# EAGLE design main (EAGLE 9.3.1)
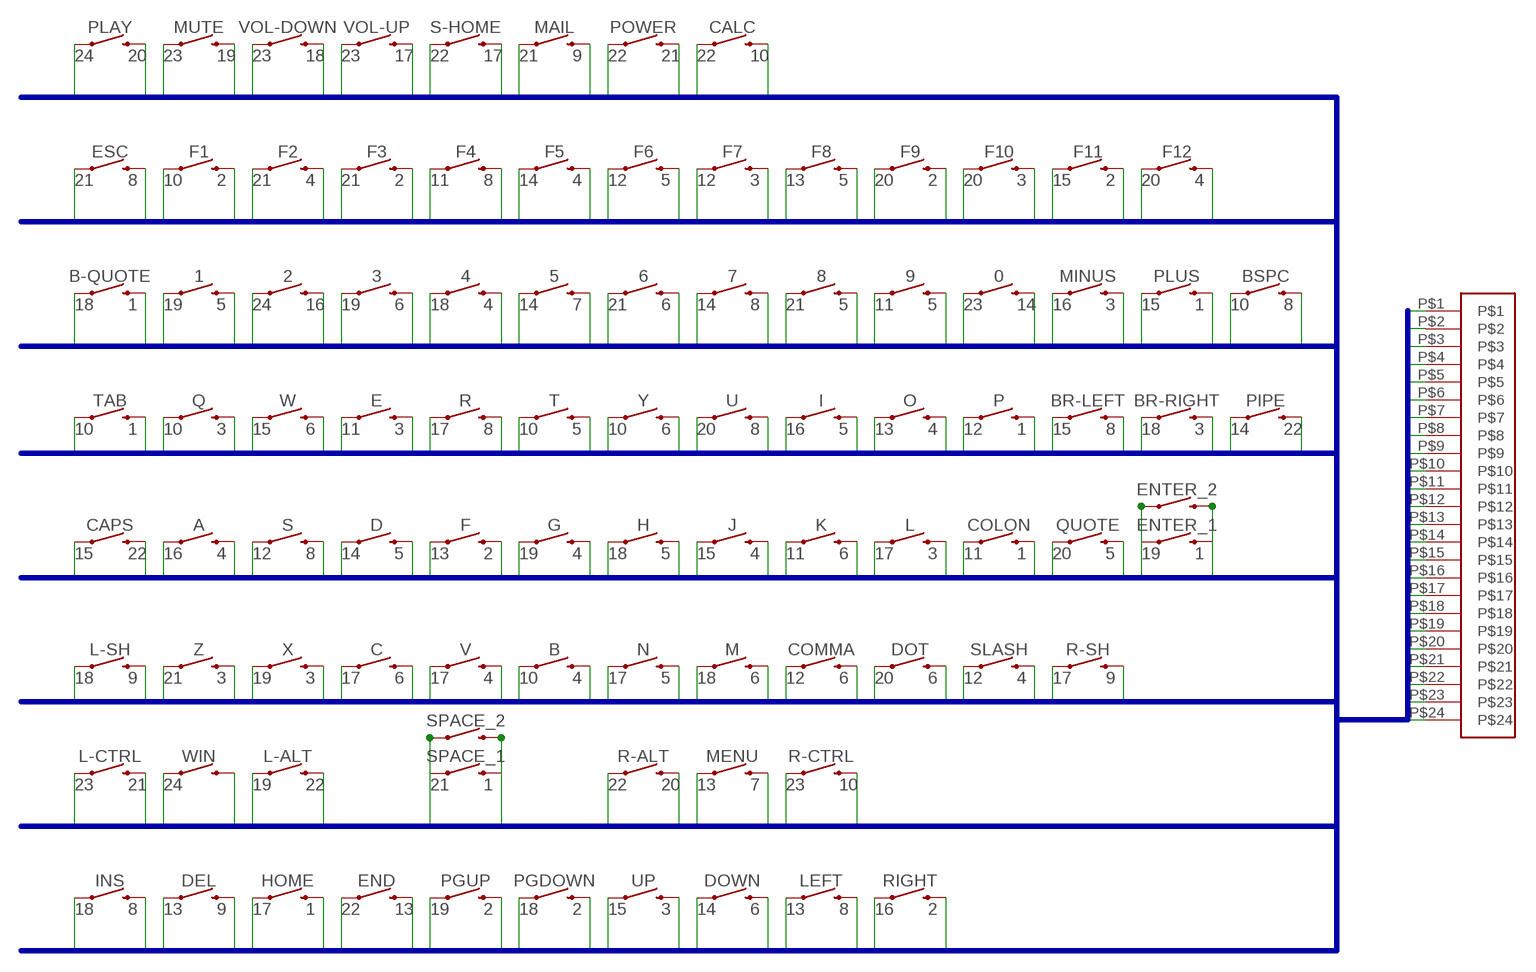
[diagram p0: schematic, sheet 1]

## Parts
0  MOMENTARY-SWITCH-SPST-SMD-5.2MM-TALL  [TACTILE_SWITCH_SMD_5.2MM]
1  MOMENTARY-SWITCH-SPST-SMD-5.2MM-TALL  [TACTILE_SWITCH_SMD_5.2MM]
2  MOMENTARY-SWITCH-SPST-SMD-5.2MM-TALL  [TACTILE_SWITCH_SMD_5.2MM]
3  MOMENTARY-SWITCH-SPST-SMD-5.2MM-TALL  [TACTILE_SWITCH_SMD_5.2MM]
4  MOMENTARY-SWITCH-SPST-SMD-5.2MM-TALL  [TACTILE_SWITCH_SMD_5.2MM]
5  MOMENTARY-SWITCH-SPST-SMD-5.2MM-TALL  [TACTILE_SWITCH_SMD_5.2MM]
6  MOMENTARY-SWITCH-SPST-SMD-5.2MM-TALL  [TACTILE_SWITCH_SMD_5.2MM]
7  MOMENTARY-SWITCH-SPST-SMD-5.2MM-TALL  [TACTILE_SWITCH_SMD_5.2MM]
8  MOMENTARY-SWITCH-SPST-SMD-5.2MM-TALL  [TACTILE_SWITCH_SMD_5.2MM]
9  MOMENTARY-SWITCH-SPST-SMD-5.2MM-TALL  [TACTILE_SWITCH_SMD_5.2MM]
A  MOMENTARY-SWITCH-SPST-SMD-5.2MM-TALL  [TACTILE_SWITCH_SMD_5.2MM]
B  MOMENTARY-SWITCH-SPST-SMD-5.2MM-TALL  [TACTILE_SWITCH_SMD_5.2MM]
B-QUOTE  MOMENTARY-SWITCH-SPST-SMD-5.2MM-TALL  [TACTILE_SWITCH_SMD_5.2MM]
BR-LEFT  MOMENTARY-SWITCH-SPST-SMD-5.2MM-TALL  [TACTILE_SWITCH_SMD_5.2MM]
BR-RIGHT  MOMENTARY-SWITCH-SPST-SMD-5.2MM-TALL  [TACTILE_SWITCH_SMD_5.2MM]
BSPC  MOMENTARY-SWITCH-SPST-SMD-5.2MM-TALL  [TACTILE_SWITCH_SMD_5.2MM]
C  MOMENTARY-SWITCH-SPST-SMD-5.2MM-TALL  [TACTILE_SWITCH_SMD_5.2MM]
CALC  MOMENTARY-SWITCH-SPST-SMD-5.2MM-TALL  [TACTILE_SWITCH_SMD_5.2MM]
CAPS  MOMENTARY-SWITCH-SPST-SMD-5.2MM-TALL  [TACTILE_SWITCH_SMD_5.2MM]
COLON  MOMENTARY-SWITCH-SPST-SMD-5.2MM-TALL  [TACTILE_SWITCH_SMD_5.2MM]
COMMA  MOMENTARY-SWITCH-SPST-SMD-5.2MM-TALL  [TACTILE_SWITCH_SMD_5.2MM]
D  MOMENTARY-SWITCH-SPST-SMD-5.2MM-TALL  [TACTILE_SWITCH_SMD_5.2MM]
DEL  MOMENTARY-SWITCH-SPST-SMD-5.2MM-TALL  [TACTILE_SWITCH_SMD_5.2MM]
DOT  MOMENTARY-SWITCH-SPST-SMD-5.2MM-TALL  [TACTILE_SWITCH_SMD_5.2MM]
DOWN  MOMENTARY-SWITCH-SPST-SMD-5.2MM-TALL  [TACTILE_SWITCH_SMD_5.2MM]
E  MOMENTARY-SWITCH-SPST-SMD-5.2MM-TALL  [TACTILE_SWITCH_SMD_5.2MM]
END  MOMENTARY-SWITCH-SPST-SMD-5.2MM-TALL  [TACTILE_SWITCH_SMD_5.2MM]
ENTER_1  MOMENTARY-SWITCH-SPST-SMD-5.2MM-TALL  [TACTILE_SWITCH_SMD_5.2MM]
ENTER_2  MOMENTARY-SWITCH-SPST-SMD-5.2MM-TALL  [TACTILE_SWITCH_SMD_5.2MM]
ESC  MOMENTARY-SWITCH-SPST-SMD-5.2MM-TALL  [TACTILE_SWITCH_SMD_5.2MM]
F  MOMENTARY-SWITCH-SPST-SMD-5.2MM-TALL  [TACTILE_SWITCH_SMD_5.2MM]
F1  MOMENTARY-SWITCH-SPST-SMD-5.2MM-TALL  [TACTILE_SWITCH_SMD_5.2MM]
F2  MOMENTARY-SWITCH-SPST-SMD-5.2MM-TALL  [TACTILE_SWITCH_SMD_5.2MM]
F3  MOMENTARY-SWITCH-SPST-SMD-5.2MM-TALL  [TACTILE_SWITCH_SMD_5.2MM]
F4  MOMENTARY-SWITCH-SPST-SMD-5.2MM-TALL  [TACTILE_SWITCH_SMD_5.2MM]
F5  MOMENTARY-SWITCH-SPST-SMD-5.2MM-TALL  [TACTILE_SWITCH_SMD_5.2MM]
F6  MOMENTARY-SWITCH-SPST-SMD-5.2MM-TALL  [TACTILE_SWITCH_SMD_5.2MM]
F7  MOMENTARY-SWITCH-SPST-SMD-5.2MM-TALL  [TACTILE_SWITCH_SMD_5.2MM]
F8  MOMENTARY-SWITCH-SPST-SMD-5.2MM-TALL  [TACTILE_SWITCH_SMD_5.2MM]
F9  MOMENTARY-SWITCH-SPST-SMD-5.2MM-TALL  [TACTILE_SWITCH_SMD_5.2MM]
F10  MOMENTARY-SWITCH-SPST-SMD-5.2MM-TALL  [TACTILE_SWITCH_SMD_5.2MM]
F11  MOMENTARY-SWITCH-SPST-SMD-5.2MM-TALL  [TACTILE_SWITCH_SMD_5.2MM]
F12  MOMENTARY-SWITCH-SPST-SMD-5.2MM-TALL  [TACTILE_SWITCH_SMD_5.2MM]
G  MOMENTARY-SWITCH-SPST-SMD-5.2MM-TALL  [TACTILE_SWITCH_SMD_5.2MM]
H  MOMENTARY-SWITCH-SPST-SMD-5.2MM-TALL  [TACTILE_SWITCH_SMD_5.2MM]
HOME  MOMENTARY-SWITCH-SPST-SMD-5.2MM-TALL  [TACTILE_SWITCH_SMD_5.2MM]
I  MOMENTARY-SWITCH-SPST-SMD-5.2MM-TALL  [TACTILE_SWITCH_SMD_5.2MM]
INS  MOMENTARY-SWITCH-SPST-SMD-5.2MM-TALL  [TACTILE_SWITCH_SMD_5.2MM]
J  MOMENTARY-SWITCH-SPST-SMD-5.2MM-TALL  [TACTILE_SWITCH_SMD_5.2MM]
K  MOMENTARY-SWITCH-SPST-SMD-5.2MM-TALL  [TACTILE_SWITCH_SMD_5.2MM]
L  MOMENTARY-SWITCH-SPST-SMD-5.2MM-TALL  [TACTILE_SWITCH_SMD_5.2MM]
L-ALT  MOMENTARY-SWITCH-SPST-SMD-5.2MM-TALL  [TACTILE_SWITCH_SMD_5.2MM]
L-CTRL  MOMENTARY-SWITCH-SPST-SMD-5.2MM-TALL  [TACTILE_SWITCH_SMD_5.2MM]
L-SH  MOMENTARY-SWITCH-SPST-SMD-5.2MM-TALL  [TACTILE_SWITCH_SMD_5.2MM]
LEFT  MOMENTARY-SWITCH-SPST-SMD-5.2MM-TALL  [TACTILE_SWITCH_SMD_5.2MM]
M  MOMENTARY-SWITCH-SPST-SMD-5.2MM-TALL  [TACTILE_SWITCH_SMD_5.2MM]
MAIL  MOMENTARY-SWITCH-SPST-SMD-5.2MM-TALL  [TACTILE_SWITCH_SMD_5.2MM]
MENU  MOMENTARY-SWITCH-SPST-SMD-5.2MM-TALL  [TACTILE_SWITCH_SMD_5.2MM]
MINUS  MOMENTARY-SWITCH-SPST-SMD-5.2MM-TALL  [TACTILE_SWITCH_SMD_5.2MM]
MUTE  MOMENTARY-SWITCH-SPST-SMD-5.2MM-TALL  [TACTILE_SWITCH_SMD_5.2MM]
N  MOMENTARY-SWITCH-SPST-SMD-5.2MM-TALL  [TACTILE_SWITCH_SMD_5.2MM]
O  MOMENTARY-SWITCH-SPST-SMD-5.2MM-TALL  [TACTILE_SWITCH_SMD_5.2MM]
P  MOMENTARY-SWITCH-SPST-SMD-5.2MM-TALL  [TACTILE_SWITCH_SMD_5.2MM]
PGDOWN  MOMENTARY-SWITCH-SPST-SMD-5.2MM-TALL  [TACTILE_SWITCH_SMD_5.2MM]
PGUP  MOMENTARY-SWITCH-SPST-SMD-5.2MM-TALL  [TACTILE_SWITCH_SMD_5.2MM]
PIPE  MOMENTARY-SWITCH-SPST-SMD-5.2MM-TALL  [TACTILE_SWITCH_SMD_5.2MM]
PLAY  MOMENTARY-SWITCH-SPST-SMD-5.2MM-TALL  [TACTILE_SWITCH_SMD_5.2MM]
PLUS  MOMENTARY-SWITCH-SPST-SMD-5.2MM-TALL  [TACTILE_SWITCH_SMD_5.2MM]
POWER  MOMENTARY-SWITCH-SPST-SMD-5.2MM-TALL  [TACTILE_SWITCH_SMD_5.2MM]
Q  MOMENTARY-SWITCH-SPST-SMD-5.2MM-TALL  [TACTILE_SWITCH_SMD_5.2MM]
QUOTE  MOMENTARY-SWITCH-SPST-SMD-5.2MM-TALL  [TACTILE_SWITCH_SMD_5.2MM]
R  MOMENTARY-SWITCH-SPST-SMD-5.2MM-TALL  [TACTILE_SWITCH_SMD_5.2MM]
R-ALT  MOMENTARY-SWITCH-SPST-SMD-5.2MM-TALL  [TACTILE_SWITCH_SMD_5.2MM]
R-CTRL  MOMENTARY-SWITCH-SPST-SMD-5.2MM-TALL  [TACTILE_SWITCH_SMD_5.2MM]
R-SH  MOMENTARY-SWITCH-SPST-SMD-5.2MM-TALL  [TACTILE_SWITCH_SMD_5.2MM]
RIGHT  MOMENTARY-SWITCH-SPST-SMD-5.2MM-TALL  [TACTILE_SWITCH_SMD_5.2MM]
S  MOMENTARY-SWITCH-SPST-SMD-5.2MM-TALL  [TACTILE_SWITCH_SMD_5.2MM]
S-HOME  MOMENTARY-SWITCH-SPST-SMD-5.2MM-TALL  [TACTILE_SWITCH_SMD_5.2MM]
SLASH  MOMENTARY-SWITCH-SPST-SMD-5.2MM-TALL  [TACTILE_SWITCH_SMD_5.2MM]
SPACE_1  MOMENTARY-SWITCH-SPST-SMD-5.2MM-TALL  [TACTILE_SWITCH_SMD_5.2MM]
SPACE_2  MOMENTARY-SWITCH-SPST-SMD-5.2MM-TALL  [TACTILE_SWITCH_SMD_5.2MM]
T  MOMENTARY-SWITCH-SPST-SMD-5.2MM-TALL  [TACTILE_SWITCH_SMD_5.2MM]
TAB  MOMENTARY-SWITCH-SPST-SMD-5.2MM-TALL  [TACTILE_SWITCH_SMD_5.2MM]
U  MOMENTARY-SWITCH-SPST-SMD-5.2MM-TALL  [TACTILE_SWITCH_SMD_5.2MM]
U$1  LOGITECH_KBD_24_PIN_CONNECTOR  [LOGITECH_KBD_24_PIN_CONNECTOR]
UP  MOMENTARY-SWITCH-SPST-SMD-5.2MM-TALL  [TACTILE_SWITCH_SMD_5.2MM]
V  MOMENTARY-SWITCH-SPST-SMD-5.2MM-TALL  [TACTILE_SWITCH_SMD_5.2MM]
VOL-DOWN  MOMENTARY-SWITCH-SPST-SMD-5.2MM-TALL  [TACTILE_SWITCH_SMD_5.2MM]
VOL-UP  MOMENTARY-SWITCH-SPST-SMD-5.2MM-TALL  [TACTILE_SWITCH_SMD_5.2MM]
W  MOMENTARY-SWITCH-SPST-SMD-5.2MM-TALL  [TACTILE_SWITCH_SMD_5.2MM]
WIN  MOMENTARY-SWITCH-SPST-SMD-5.2MM-TALL  [TACTILE_SWITCH_SMD_5.2MM]
X  MOMENTARY-SWITCH-SPST-SMD-5.2MM-TALL  [TACTILE_SWITCH_SMD_5.2MM]
Y  MOMENTARY-SWITCH-SPST-SMD-5.2MM-TALL  [TACTILE_SWITCH_SMD_5.2MM]
Z  MOMENTARY-SWITCH-SPST-SMD-5.2MM-TALL  [TACTILE_SWITCH_SMD_5.2MM]

## Nets
1: B-QUOTE.3 COLON.3 ENTER_1.3 ENTER_2.3 HOME.3 P.3 PLUS.3 SPACE_1.3 SPACE_2.3 TAB.3 U$1.P$1
2: F1.3 F3.3 F9.3 F11.3 F.3 PGDOWN.3 PGUP.3 RIGHT.3 U$1.P$2
3: BR-RIGHT.3 E.3 F7.3 F10.3 L.3 MINUS.3 Q.3 U$1.P$3 UP.3 X.3 Z.3
4: 4.3 A.3 B.3 F2.3 F5.3 F12.3 G.3 J.3 O.3 SLASH.3 U$1.P$4 V.3
5: 1.3 8.3 9.3 D.3 F6.3 F8.3 H.3 I.3 N.3 QUOTE.3 T.3 U$1.P$5
6: 3.3 6.3 C.3 COMMA.3 DOT.3 DOWN.3 K.3 M.3 U$1.P$6 W.3 Y.3
7: 5.3 MENU.3 U$1.P$7
8: 7.3 BR-LEFT.3 BSPC.3 ESC.3 F4.3 INS.3 LEFT.3 R.3 S.3 U$1.P$8 U.3
9: DEL.3 L-SH.3 MAIL.3 R-SH.3 U$1.P$9
10: B.1 BSPC.1 CALC.3 F1.1 Q.1 R-CTRL.3 T.1 TAB.1 U$1.P$10 Y.1
11: 9.1 COLON.1 E.1 F4.1 K.1 U$1.P$11 WIN.3
12: COMMA.1 F6.1 F7.1 P.1 S.1 SLASH.1 U$1.P$12
13: DEL.1 END.3 F8.1 F.1 LEFT.1 MENU.1 O.1 U$1.P$13
14: 0.3 5.1 7.1 D.1 DOWN.1 F5.1 PIPE.1 U$1.P$14
15: BR-LEFT.1 CAPS.1 F11.1 J.1 PLUS.1 U$1.P$15 UP.1 W.1
16: 2.3 A.1 I.1 MINUS.1 RIGHT.1 U$1.P$16
17: C.1 HOME.1 L.1 N.1 R-SH.1 R.1 S-HOME.3 U$1.P$17 V.1 VOL-UP.3
18: 4.1 B-QUOTE.1 BR-RIGHT.1 H.1 INS.1 L-SH.1 M.1 PGDOWN.1 U$1.P$18 VOL-DOWN.3
19: 1.1 3.1 ENTER_1.1 ENTER_2.1 G.1 L-ALT.1 MUTE.3 PGUP.1 U$1.P$19 X.1
20: DOT.1 F9.1 F10.1 F12.1 PLAY.3 QUOTE.1 R-ALT.3 U$1.P$20 U.1
21: 6.1 8.1 ESC.1 F2.1 F3.1 L-CTRL.3 MAIL.1 POWER.3 SPACE_1.1 SPACE_2.1 U$1.P$21 Z.1
22: CALC.1 CAPS.3 END.1 L-ALT.3 PIPE.3 POWER.1 R-ALT.1 S-HOME.1 U$1.P$22
23: 0.1 L-CTRL.1 MUTE.1 R-CTRL.1 U$1.P$23 VOL-DOWN.1 VOL-UP.1
24: 2.1 PLAY.1 U$1.P$24 WIN.1

## Buses
1,2,3,4,5,6,7,8,9,10,11,12,13,14,15,16,17,18,19,20,21,22,23,24

## Library data of the parts
0 1-9 A B B-QUOTE BR-LEFT BR-RIGHT BSPC C CALC CAPS COLON COMMA D DEL DOT DOWN E END ENTER_1 ENTER_2 ESC F F1-F12 G H HOME I INS J K L L-ALT L-CTRL L-SH LEFT M MAIL MENU MINUS MUTE N O P PGDOWN PGUP PIPE PLAY PLUS POWER Q QUOTE R R-ALT R-CTRL R-SH RIGHT S S-HOME SLASH SPACE_1 SPACE_2 T TAB U UP V VOL-DOWN VOL-UP W WIN X Y Z = SparkFun-Switches:MOMENTARY-SWITCH-SPST: Momentary Switch (Pushbutton) - SPST Normally-open (NO) SPST momentary switches (buttons, pushbuttons). Variants PTH-12MM - 12mm square, through-hole Momentary Pushbutton Switch - 12mm Square <https://www.sparkfun.com/products/9190> (COM-09190) PTH-6.0MM, PTH-6.0MM-KIT - 6.0mm square, through-hole Mini Pushbutton Switch <https://www.sparkfun.com/products/97> (COM-00097) KIT package intended for soldering kit's - only one side of pads' copper is exposed. PTH-RIGHT-ANGLE-KIT - Right-angle, through-hole Right Angle Tactile Button <https://www.sparkfun.com/products/10791> - Used on SparkFun BigTime Watch Kit <https://www.sparkfun.com/products/11734> SMD-12MM - 12mm square, surface-mount Tactile Button - SMD (12mm) <https://www.sparkfun.com/products/12993> (COM-12993) Used on SparkFun PicoBoard <https://www.sparkfun.com/products/11888> SMD-4.5MM - 4.5mm Square Trackball Switch Used on SparkFun Blackberry Trackballer Breakout <https://www.sparkfun.com/products/13169> SMD-4.6MMX2.8MM - 4.60mm x 2.80mm, surface mount Used on SparkFun SAMD21 Mini Breakout <https://www.sparkfun.com/products/13664> SMD-5.2MM, SMD-5.2-REDUNDANT - 5.2mm square, surface-mount Mini Pushbutton Switch - SMD <https://www.sparkfun.com/products/8720> (COM-08720) Used on Arduino Pro Mini <https://www.sparkfun.com/products/11114> REDUNDANT package connects both switch circuits together SMD-6.0X3.5MM - 6.0 x 3.5mm, surface mount Momentary Reset Switch SMD <https://www.sparkfun.com/products/8229> (COM-08229) SMD-6.2MM-TALL - 6.2mm square, surface mount Tactile Button - SMD (6mm) <https://www.sparkfun.com/products/12992> Used on SparkFun Digital Sandbox <https://www.sparkfun.com/products/12651> SMD-RIGHT-ANGLE - Right-angle, surface mount Used on SparkFun Block for Intel® Edison - Arduino <https://www.sparkfun.com/products/13036>; PROD_ID: SWCH-14139
U$1 = Andrew:LOGITECH_KBD_24_PIN_CONNECTOR

## Net classes
0 default: width 0.203 mm, drill 0.3 mm, clearance 0.203 mm

## Board
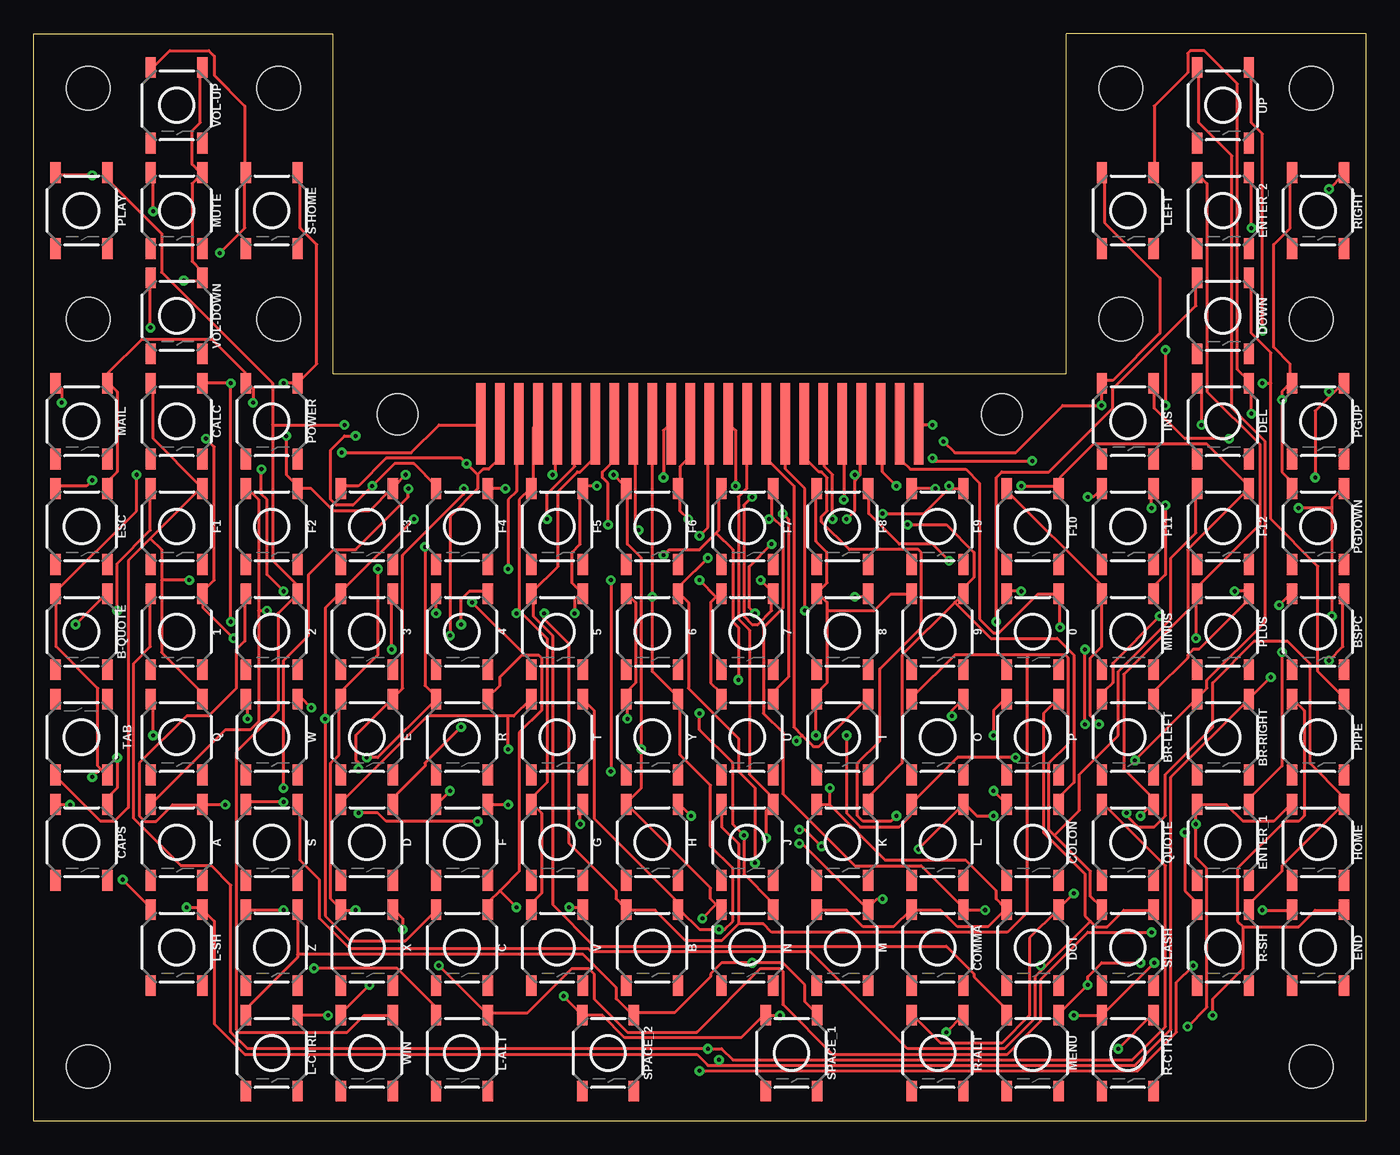
[diagram p1: board, top side]
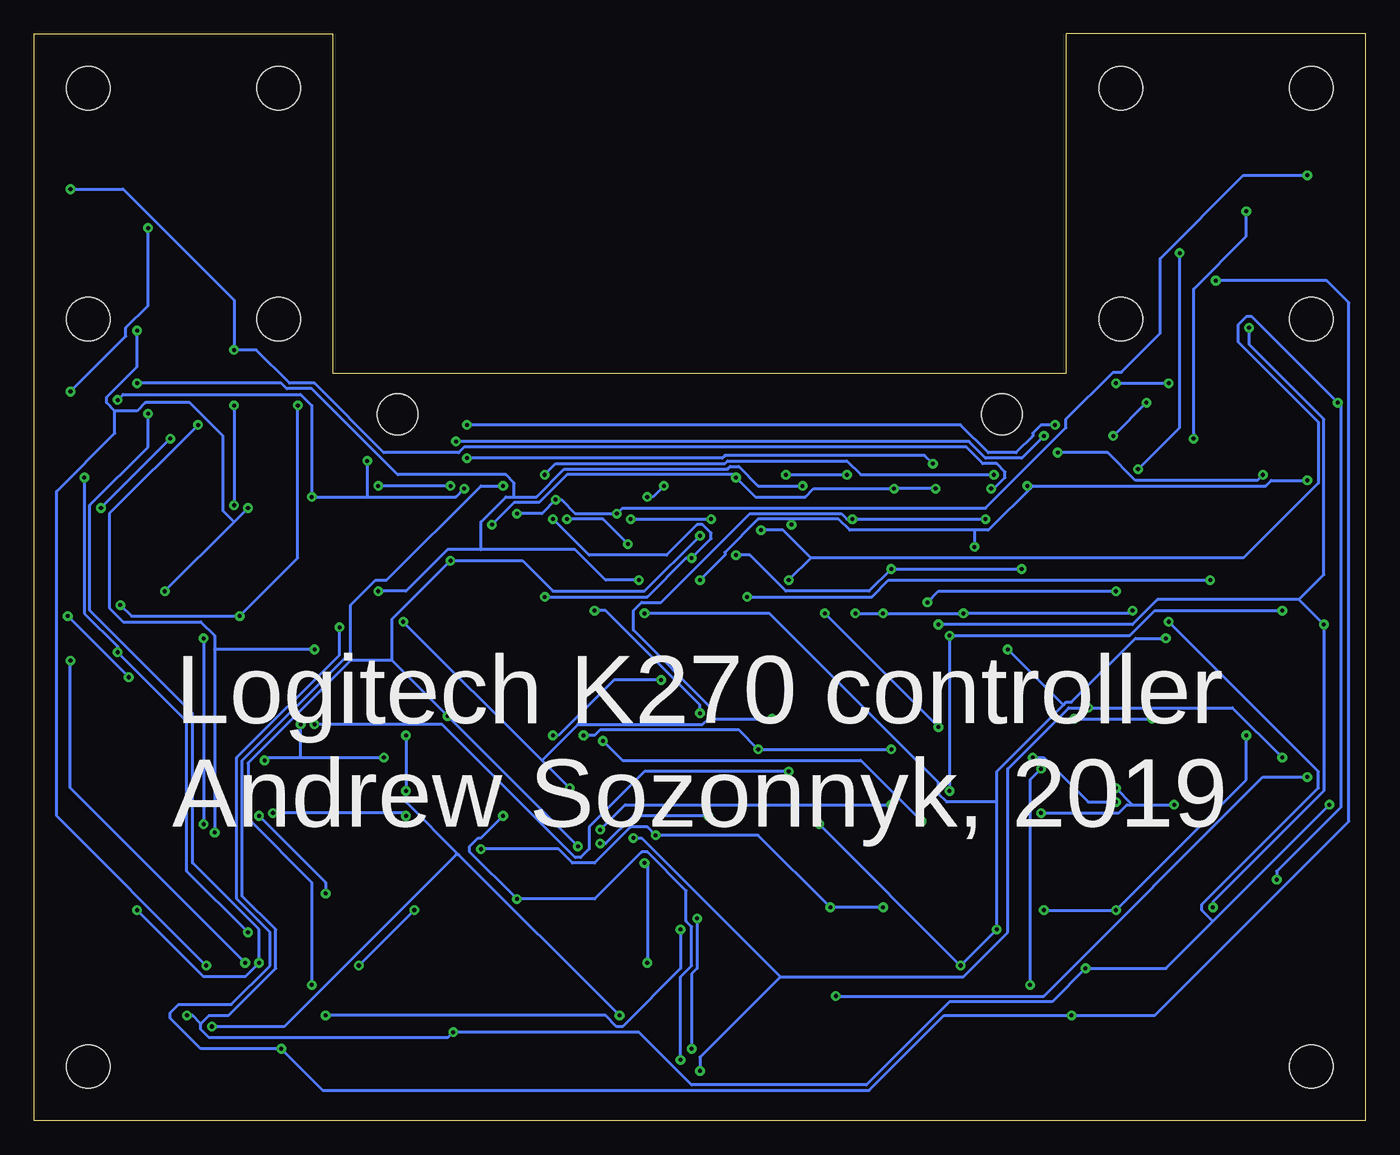
[diagram p2: board, bottom side, seen from below]

Size 98 x 80 mm. Coordinates in mm from the lower left corner, seen from the top.
Outline: 0,0 0,80 22,80 22,55 76,55 76,80 98,80 98,0 0,0
Copper layers (1*16): Top 0.035mm / dielectric 1.5mm / Bottom 0.035mm
Design rules "PCBway": minimum track width 6mil, minimum drill 0.3mm, track to track 0.205mm, track to pad 0.205mm, pad to pad 0.205mm, via to via 0.205mm, smd to smd 8mil, copper to edge 40mil, drill to drill 8mil, minimum pad ring 10mil, minimum via ring 8mil, stop-mask expansion 4mil, vias tented up to drill 25mil, thermal gap 10mil
Holes 3.2 mm at 4,4 94,4 4,76 94,76 18,76 80,76 4,59 18,59 80,59 94,59
Holes 3 mm at 26.75,52 71.25,52

### Footprints (pad centres in the part's own frame; a part is rotated, then mirrored left to right if it is on the bottom)
TACTILE_SWITCH_SMD_5.2MM = smd 1.524 x 0.762: 1 -2.794,1.905; 2 2.794,1.905; 3 -2.794,-1.905; 4 2.794,-1.905
LOGITECH_KBD_24_PIN_CONNECTOR = smd 0.7 x 6: P$1 0,0; P$2 1.4,0; P$3 2.8,0; P$4 4.2,0; P$5 5.6,0; P$6 7,0; P$7 8.4,0; P$8 9.8,0; P$9 11.2,0; P$10 12.6,0; P$11 14,0; P$12 15.4,0; P$13 16.8,0; P$14 18.2,0; P$15 19.6,0; P$16 21,0; P$17 22.4,0; P$18 23.8,0; P$19 25.2,0; P$20 26.6,0; P$21 28,0; P$22 29.4,0; P$23 30.8,0; P$24 32.2,0

### Placement (x,y rotation side)
0  73.5,36 270 top
1  10.5,36 270 top
2  17.5,36 270 top
3  24.5,36 270 top
4  31.5,36 270 top
5  38.5,36 270 top
6  45.5,36 270 top
7  52.5,36 270 top
8  59.5,36 270 top
9  66.5,36 270 top
A  10.5,20.5 270 top
B  45.5,12.75 270 top
B-QUOTE  3.5,36 270 top
BR-LEFT  80.5,28.25 270 top
BR-RIGHT  87.5,28.25 270 top
BSPC  94.5,36 270 top
C  31.5,12.75 270 top
CALC  10.5,51.5 270 top
CAPS  3.5,20.5 270 top
COLON  73.5,20.5 270 top
COMMA  66.5,12.75 270 top
D  24.5,20.5 270 top
DEL  87.5,51.5 270 top
DOT  73.5,12.75 270 top
DOWN  87.5,59.25 270 top
E  24.5,28.25 270 top
END  94.5,12.75 270 top
ENTER_1  87.5,20.5 270 top
ENTER_2  87.5,67 270 top
ESC  3.5,43.75 270 top
F  31.5,20.5 270 top
F1  10.5,43.75 270 top
F2  17.5,43.75 270 top
F3  24.5,43.75 270 top
F4  31.5,43.75 270 top
F5  38.5,43.75 270 top
F6  45.5,43.75 270 top
F7  52.5,43.75 270 top
F8  59.5,43.75 270 top
F9  66.5,43.75 270 top
F10  73.5,43.75 270 top
F11  80.5,43.75 270 top
F12  87.5,43.75 270 top
G  38.5,20.5 270 top
H  45.5,20.5 270 top
HOME  94.5,20.5 270 top
I  59.5,28.25 270 top
INS  80.5,51.5 270 top
J  52.5,20.5 270 top
K  59.5,20.5 270 top
L  66.5,20.5 270 top
L-ALT  31.5,5 270 top
L-CTRL  17.5,5 270 top
L-SH  10.5,12.75 270 top
LEFT  80.5,67 270 top
M  59.5,12.75 270 top
MAIL  3.5,51.5 270 top
MENU  73.5,5 270 top
MINUS  80.5,36 270 top
MUTE  10.5,67 270 top
N  52.5,12.75 270 top
O  66.5,28.25 270 top
P  73.5,28.25 270 top
PGDOWN  94.5,43.75 270 top
PGUP  94.5,51.5 270 top
PIPE  94.5,28.25 270 top
PLAY  3.5,67 270 top
PLUS  87.5,36 270 top
POWER  17.5,51.5 270 top
Q  10.5,28.25 270 top
QUOTE  80.5,20.5 270 top
R  31.5,28.25 270 top
R-ALT  66.5,5 270 top
R-CTRL  80.5,5 270 top
R-SH  87.5,12.75 270 top
RIGHT  94.5,67 270 top
S  17.5,20.5 270 top
S-HOME  17.5,67 270 top
SLASH  80.5,12.75 270 top
SPACE_1  55.75,5 270 top
SPACE_2  42.25,5 270 top
T  38.5,28.25 270 top
TAB  3.5,28.25 90 top
U  52.5,28.25 270 top
U$1  32.9,51.3 0 top
UP  87.5,74.75 270 top
V  38.5,12.75 270 top
VOL-DOWN  10.5,59.25 270 top
VOL-UP  10.5,74.75 270 top
W  17.5,28.25 270 top
WIN  24.5,5 270 top
X  24.5,12.75 270 top
Y  45.5,28.25 270 top
Z  17.5,12.75 270 top

### Tracks (layer width: path | path; a pad name or v marks a point on that pad's centre or on a via)
1  (via drill 0.3)
  Top 0.203: 4.9,25.92 5.31,25.51 TAB.3 | 4.9,25.92 4.69,26.12 4.69,31.84 1.63,34.9 1.63,38.78 B-QUOTE.3 1.63,38.98 7.55,44.9 v7.55,47.55 | v22.66,49.19 27.76,49.19 29.8,51.23 32.86,51.23 U$1.P$1 | HOME.3 92.46,23.27 91.23,22.04 88.99,22.04 87.76,23.27 85.72,23.27 ENTER_1.3 85.52,23.27 v85.52,21.84 85.52,19.39 86.33,18.57 86.33,8.37 v84.91,6.94 | ENTER_2.3 85.72,69.6 86.33,68.99 86.33,53.68 90.21,49.8 90.21,43.88 85.72,39.39 85.72,38.98 PLUS.3 85.52,38.78 v85.52,35.51 | v70.62,24.29 71.44,23.47 COLON.3 | v70.62,28.37 70.62,30.21 71.44,31.02 P.3 | v54.9,7.76 53.88,7.76 SPACE_1.3 53.68,7.76 52.05,6.12 43.47,6.12 41.84,7.76 40.41,7.76 SPACE_2.3 40.21,7.96 v38.98,9.18 | v4.29,25.31 4.9,25.92
  Bottom 0.203: v22.66,49.19 18.98,49.19 16.94,47.15 7.96,47.15 v7.55,47.55 | v85.52,35.51 v85.52,21.84 | v70.62,28.37 v70.62,24.29 70.62,23.47 66.74,19.59 | v54.9,7.76 66.74,19.59 | v84.91,6.94 79.6,6.94 66.94,19.59 66.74,19.59 | v4.29,25.31 7.55,25.31 23.68,9.18 v38.98,9.18
2  (via drill 0.3)
  Top 0.203: v66.33,46.53 64.7,46.53 F9.3 | v77.56,45.92 77.97,45.92 78.58,46.53 F11.3 | PGDOWN.3 92.46,46.74 92.46,47.15 91.84,47.76 v91.84,53.07 91.84,53.68 92.46,54.29 PGUP.3 92.46,54.49 92.46,55.72 91.23,56.94 91.23,64.5 92.46,65.72 92.46,69.6 RIGHT.3 | v30.61,24.29 29.8,23.47 F.3 | v30.61,35.72 30.61,44.49 32.66,46.53 32.66,47.55 | 32.66,47.55 33.06,47.96 33.47,47.96 34.29,48.78 34.29,51.23 U$1.P$2 | v6.12,37.55 6.12,41.02 8.57,43.47 8.57,46.53 F1.3 | 32.66,47.55 v31.84,48.37 31.43,48.78 25.92,48.78 23.88,46.74 22.66,46.74 F3.3 | v73.48,48.58 66.33,48.58 v66.13,48.78
  Bottom 0.203: v66.33,46.53 66.94,45.92 73.48,45.92 | 73.48,45.92 v77.56,45.92 77.56,52.66 78.37,53.47 91.44,53.47 v91.84,53.07 | v30.61,24.29 v30.61,35.72 17.35,35.72 15.51,37.55 v6.12,37.55 | v73.48,48.58 73.48,45.92 | v66.13,48.78 47.35,48.78 47.15,48.98 32.45,48.98 v31.84,48.37
3  (via drill 0.3)
  Top 0.203: F10.3 71.44,46.53 78.58,39.39 78.58,38.98 MINUS.3 78.58,38.78 78.58,34.9 77.76,34.09 77.76,29.8 v78.37,29.19 | v72.25,26.74 67.97,26.74 64.7,23.47 L.3 64.5,23.27 64.5,22.45 63.68,21.64 60.82,21.64 59.8,22.66 v59.8,28.37 | v81.03,26.53 85.52,31.02 BR-RIGHT.3 85.72,31.23 86.33,31.84 86.33,32.45 90.62,36.74 90.62,50.01 88.17,52.45 88.17,71.03 85.72,73.48 85.72,77.35 UP.3 | v18.37,15.51 15.72,15.51 Z.3 | v23.68,15.51 22.66,15.51 X.3 22.45,15.72 21.84,16.33 21.84,26.33 22.45,26.94 22.45,31.02 E.3 22.66,31.23 22.66,31.64 25.31,34.29 v25.31,40.62 | v8.78,28.37 8.78,31.02 Q.3 | 50.21,43.27 48.98,42.05 46.74,42.05 v46.33,41.64 | 50.21,43.27 50.41,43.47 50.41,46.53 F7.3 | v34.9,40.62 34.9,45.72 35.51,46.33 35.51,51.23 U$1.P$3 | v51.84,32.45 51.84,36.33 51.43,36.74 51.43,42.05 50.21,43.27
  Bottom 0.203: 78.37,26.74 80.82,26.74 v81.03,26.53 | 78.37,26.74 v72.25,26.74 | 78.37,26.74 v78.37,29.19 | v23.68,15.51 v18.37,15.51 8.78,25.1 v8.78,28.37 | v46.33,41.64 45.31,41.64 42.66,38.98 36.53,38.98 v34.9,40.62 v25.31,40.62 | v59.8,28.37 59.39,28.37 55.31,32.45 v51.84,32.45
4  (via drill 0.3)
  Top 0.203: 16.53,37.55 16.53,45.72 15.72,46.53 F2.3 | 16.53,37.55 16.53,29.39 15.92,28.78 14.08,28.78 8.78,23.47 A.3 | v29.59,37.35 4.3 | 16.53,37.55 v17.14,37.55 | V.3 36.74,15.72 36.74,16.12 37.35,16.74 37.35,22.66 36.74,23.27 G.3 36.74,23.47 36.74,23.88 37.76,24.9 37.76,35.51 35.72,37.55 | U$1.P$4 36.94,51.23 36.74,51.02 36.74,46.74 F5.3 36.53,46.53 35.72,45.72 35.72,37.55 | 35.72,37.55 v35.51,37.35 | 51.84,14.49 50.62,13.27 47.96,13.27 45.72,15.51 43.68,15.51 B.3 43.47,15.72 42.86,16.33 42.86,16.94 39.39,20.41 39.39,35.1 37.55,36.94 v37.55,37.35 | 51.84,14.49 51.84,20.41 50.62,21.64 50.62,23.27 J.3 | 73.07,34.29 75.92,34.29 76.13,34.09 76.13,27.76 74.7,26.33 74.7,21.43 75.11,21.02 | 73.07,34.29 67.76,34.29 64.7,31.23 O.3 | 75.11,21.02 77.76,18.37 77.76,16.53 78.58,15.72 SLASH.3 | 75.11,21.02 76.95,22.86 76.95,25.51 79.8,28.37 79.8,33.06 83.68,36.94 83.68,41.43 85.52,43.27 85.52,46.53 F12.3 | 51.84,14.49 53.68,14.49 54.29,13.88 71.64,13.88 73.07,15.31 73.07,34.29
  Bottom 0.203: v17.14,37.55 17.35,37.35 v29.59,37.35 v35.51,37.35 v37.55,37.35
5  (via drill 0.3)
  Top 0.203: 58.37,37.55 58.37,38.17 57.76,38.78 8.3 57.76,38.98 58.37,39.59 58.37,41.84 57.56,42.66 57.56,46.53 F8.3 | 58.37,37.55 58.37,32.25 57.76,31.64 57.76,31.23 I.3 57.56,31.02 v57.56,28.37 | 58.37,37.55 61.84,37.55 63.07,38.78 64.5,38.78 9.3 | 34.9,29.8 35.31,29.8 36.53,31.02 T.3 | 34.9,29.8 28.98,29.8 22.66,23.47 D.3 | 50.21,15.92 50.41,15.72 N.3 | 50.21,15.92 49.8,16.33 49.8,17.14 43.68,23.27 H.3 43.68,23.47 44.7,24.49 v44.7,27.35 44.7,41.43 43.68,42.45 43.68,46.53 F6.3 43.47,46.74 v42.66,47.55 | 50.21,15.92 v49.19,14.9 | QUOTE.3 78.78,23.27 83.27,18.78 83.27,6.94 80.82,4.49 51.43,4.49 50.62,5.31 v49.6,5.31 15.72,5.31 14.49,6.53 14.49,17.35 13.06,18.78 10.82,18.78 7.35,22.25 7.35,33.68 8.57,34.9 8.57,38.78 1.3 | v38.17,47.55 38.37,47.76 38.37,51.23 U$1.P$5 | v34.9,27.35 34.9,29.8
  Bottom 0.203: v49.6,5.31 49.6,10.82 49.19,11.23 v49.19,14.9 | v42.66,47.55 v38.17,47.55 | v34.9,27.35 v44.7,27.35 46.13,28.78 56.33,28.78 56.74,28.37 v57.56,28.37
6  (via drill 0.3)
  Top 0.203: C.3 29.59,15.51 27.35,13.27 23.27,13.27 21.43,15.1 v21.43,29.59 21.43,37.76 22.45,38.78 3.3 22.66,38.98 v27.96,44.29 | v15.72,29.59 15.72,31.02 W.3 | 6.3 43.68,38.78 44.29,38.17 44.29,32.25 43.68,31.64 43.68,31.23 Y.3 43.68,31.02 v43.68,29.59 | M.3 57.76,15.51 59.8,15.51 61.03,14.29 63.27,14.29 64.5,15.51 COMMA.3 64.7,15.51 66.74,15.51 67.97,14.29 70.21,14.29 71.44,15.51 DOT.3 71.44,15.72 70.82,16.33 70.82,16.94 68.58,19.18 62.66,19.18 58.58,23.27 | 58.58,23.27 57.76,23.27 K.3 | v70.82,36.74 70.82,47.35 71.23,47.76 74.7,47.76 79.39,52.45 79.39,53.88 85.52,60.01 85.52,61.84 DOWN.3 | 58.58,23.27 v58.58,24.49 | v37.76,44.29 37.76,46.13 39.8,48.17 39.8,51.23 U$1.P$6
  Bottom 0.203: v21.43,29.59 v15.72,29.59 | v58.58,24.49 60.62,26.53 | 60.62,26.53 v70.82,36.74 | 48.17,29.59 48.37,29.59 48.78,29.19 57.96,29.19 60.62,26.53 | 48.17,29.59 v43.68,29.59 | 48.17,29.59 48.17,30.41 53.88,36.13 53.88,37.55 53.27,38.17 51.84,38.17 45.31,44.7 38.58,44.7 38.17,44.29 v37.76,44.29 v27.96,44.29
7
  Top 0.203: MENU.3 71.44,7.96 71.44,8.37 69.19,10.61 69.19,10.82 67.15,12.86 41.23,12.86 38.17,15.92 38.17,35.72 36.74,37.15 36.74,38.78 5.3 36.74,38.98 38.58,40.82 38.58,46.33 40,47.76 40.21,47.76 41.23,48.78 41.23,51.23 U$1.P$7
8  (via drill 0.3)
  Top 0.203: LEFT.3 78.78,69.6 78.78,66.13 82.86,62.05 82.86,57.96 79.39,54.49 78.78,54.49 INS.3 78.58,54.29 v78.58,52.66 75.72,52.66 72.25,49.19 67.76,49.19 v66.94,50.01 | v82.86,37.15 79.39,33.68 79.39,32.25 78.78,31.64 78.78,31.23 BR-LEFT.3 | v91.64,37.96 92.46,38.78 BSPC.3 | v18.37,23.47 15.72,23.47 S.3 | v24.49,26.74 25.31,26.74 29.59,31.02 R.3 29.59,31.23 28.78,32.04 v28.78,42.25 | 50.21,38.58 50.41,38.78 7.3 | 50.21,38.58 49.8,38.17 49.8,32.25 50.41,31.64 50.41,31.23 U.3 | v4.29,47.15 3.88,46.74 1.63,46.74 ESC.3 | F4.3 29.59,46.74 27.96,48.37 26.53,48.37 v24.9,46.74 23.47,45.31 22.25,45.31 21.84,45.72 21.84,49.39 22.86,50.41 v23.68,50.41 | v48.98,39.8 50.21,38.58 | v42.25,43.88 42.25,46.94 41.84,47.35 41.84,47.76 42.66,48.58 42.66,51.23 U$1.P$8
  Bottom 0.203: v91.64,37.96 90.83,37.15 v82.86,37.15 78.58,41.43 v78.58,52.66 | v18.37,23.47 20.41,23.47 23.68,26.74 v24.49,26.74 | v4.29,47.15 6.94,47.15 7.35,46.74 24.49,46.74 | v24.9,46.74 24.49,46.74 | v48.98,39.8 47.15,41.64 47.15,41.84 44.7,44.29 42.25,44.29 | 42.25,44.29 38.78,44.29 37.96,43.47 28.78,43.47 | 28.78,43.47 27.76,43.47 24.49,46.74 | 42.25,44.29 v42.25,43.88 | 28.78,43.47 v28.78,42.25 | v66.94,50.01 29.19,50.01 27.96,48.78 25.31,48.78 v23.68,50.41
9  (via drill 0.3)
  Top 0.203: v84.7,21.23 84.7,16.94 85.52,16.12 85.52,15.72 R-SH.3 | v85.93,51.23 85.93,54.09 85.72,54.29 DEL.3 | v6.53,17.76 8.57,15.72 L-SH.3 | v2.04,52.86 2.04,53.88 1.63,54.29 MAIL.3 | v44.49,43.47 44.29,43.68 44.29,51.23 U$1.P$9 | v77.35,29.19 v77.35,34.7 | v42.45,39.8 v42.45,25.72
  Bottom 0.203: 84.7,34.7 84.7,35.72 85.72,36.74 91.44,36.74 92.46,37.76 92.46,44.7 v85.93,51.23 | 84.7,34.7 v84.7,21.23 | v6.53,17.76 6.53,18.37 1.84,23.06 1.84,52.66 v2.04,52.86 8.37,59.19 8.78,59.19 9.39,58.58 9.39,57.35 3.47,51.43 3.47,46.94 8.98,41.43 40.82,41.43 | v44.49,43.47 42.86,43.47 40.82,41.43 | v77.35,34.7 84.7,34.7 | v77.35,29.19 67.97,29.19 58.17,19.39 57.76,19.39 57.15,20 57.15,21.64 53.07,25.72 v42.45,25.72 | 40.82,41.43 v42.45,39.8
10  (via drill 0.3)
  Top 0.203: 8.57,42.86 12.25,46.53 F1.1 12.25,46.74 8.78,50.21 8.78,54.29 CALC.3 | 8.57,42.86 6.94,41.23 6.94,23.06 5.92,22.04 4.9,22.04 1.63,25.31 TAB.1 | 9.39,39.8 9.39,42.05 8.57,42.86 | 9.39,39.8 9.39,34.49 12.25,31.64 12.25,31.23 Q.1 | T.1 40.41,31.02 41.23,30.21 41.23,22.25 47.35,16.12 47.35,15.72 B.1 47.55,15.51 48.98,14.08 v50.41,14.08 50.82,14.08 51.43,14.7 51.43,18.57 49.8,20.21 49.8,24.7 47.55,26.94 47.55,31.02 Y.1 47.35,31.23 45.51,33.06 v45.51,38.58 45.51,51.23 U$1.P$10 | v76.54,7.76 78.58,7.76 R-CTRL.3 78.78,7.96 v82.46,11.63 | v95.31,33.88 96.33,34.9 96.33,38.78 BSPC.1 | v11.43,39.8 9.39,39.8
  Bottom 0.203: v76.54,7.76 55.92,7.76 55.11,6.94 54.7,6.94 50.41,11.23 v50.41,14.08 | v95.31,33.88 95.31,24.49 v82.46,11.63 | v11.43,39.8 35.1,39.8 36.33,38.58 v45.51,38.58
11  (via drill 0.3)
  Top 0.203: 67.76,38.17 68.37,38.78 9.1 68.58,38.98 68.58,39.39 69.19,40 69.19,41.84 67.15,43.88 v64.29,43.88 | 67.76,38.17 63.88,34.29 63.88,26.33 61.43,23.88 61.43,23.47 K.1 | 67.76,38.17 70.42,35.51 75.31,35.51 76.54,34.29 76.54,24.9 75.52,23.88 75.52,23.47 COLON.1 | v34.7,46.53 33.47,46.53 F4.1 | v46.33,47.35 46.33,50.82 46.74,51.23 U$1.P$11 | v24.7,10 22.66,7.96 WIN.3 | v23.88,25.92 23.88,26.33 23.68,26.53 23.68,28.37 26.33,31.02 E.1 26.53,31.23 27.14,31.84 27.14,41.64 31.64,46.13 v31.64,46.53
  Bottom 0.203: v24.7,10 24.7,25.1 v23.88,25.92 | v31.64,46.53 v34.7,46.53 40.62,46.53 41.23,45.92 44.9,45.92 v46.33,47.35 46.53,47.55 58.78,47.55 60.82,45.51 62.66,45.51 v64.29,43.88
12  (via drill 0.3)
  Top 0.203: U$1.P$12 48.17,51.23 48.17,48.78 47.55,48.17 47.55,46.74 F6.1 47.55,46.53 47.55,44.9 v48.17,44.29 | 54.29,44.49 55.11,43.68 55.11,37.76 53.68,36.33 53.68,30 55.11,28.57 55.11,24.08 60.41,18.78 65.31,18.78 68.37,15.72 COMMA.1 68.58,15.51 v70.01,15.51 | 54.29,44.49 54.29,46.53 F7.1 | 54.29,44.49 v54.09,44.29 | 77.76,14.7 77.35,15.1 77.35,18.16 74.29,21.23 74.29,30 75.31,31.02 P.1 | 77.76,14.7 78.17,14.29 78.99,14.29 80.21,15.51 82.25,15.51 SLASH.1 | 77.76,14.7 74.29,11.23 | 74.29,11.23 73.68,10.61 73.68,7.55 71.44,5.31 64.29,5.31 57.15,12.45 41.02,12.45 40.82,12.65 23.27,12.65 21.02,14.9 21.02,17.76 19.59,19.18 19.59,23.27 S.1 | 74.29,11.23 v74.09,11.43
  Bottom 0.203: v54.09,44.29 v48.17,44.29 | v74.09,11.43 v70.01,15.51
13  (via drill 0.3)
  Top 0.203: LEFT.1 82.46,69.8 82.46,74.7 84.91,77.15 84.91,78.58 85.11,78.78 86.13,78.78 88.58,76.33 88.58,55.31 89.4,54.49 DEL.1 89.6,54.29 v89.6,52.05 | v34.9,23.27 33.47,23.27 F.1 | v56.33,21.43 56.74,21.43 v57.96,20.21 | v67.56,29.8 67.56,30.21 68.37,31.02 O.1 | v67.35,41.23 66.13,42.45 63.68,42.45 61.43,44.7 61.43,46.53 F8.1 | MENU.1 75.52,7.96 v77.56,10 77.56,10.61 78.58,11.63 v81.44,11.63 | v90.42,15.51 92.46,15.51 END.3 | v48.98,43.06 49.6,43.68 49.6,51.23 U$1.P$13
  Bottom 0.203: v34.9,23.27 54.49,23.27 v56.33,21.43 | v57.96,20.21 v67.56,29.8 71.64,33.88 | 71.64,33.88 71.64,36.94 v67.35,41.23 62.05,41.23 59.8,38.98 53.07,38.98 v48.98,43.06 | v77.56,10 77.56,17.55 82.25,22.25 82.25,26.33 74.7,33.88 71.64,33.88 | v90.42,15.51 85.52,10.61 82.46,10.61 v81.44,11.63 81.44,14.08 86.33,18.98 86.33,30 93.89,37.55 93.89,45.31 89.6,49.6 v89.6,52.05
14  (via drill 0.3)
  Top 0.203: 91.03,54.29 91.03,44.29 94.5,40.82 94.5,33.06 96.33,31.23 PIPE.1 | 91.03,54.29 91.03,56.54 89.6,57.96 89.6,61.84 DOWN.1 | v31.43,28.98 28.78,26.33 28.78,26.12 26.53,23.88 26.53,23.47 D.1 | v39.8,37.35 39.8,38.37 40.21,38.78 5.1 40.21,38.98 39.59,39.59 39.59,41.84 40.21,42.45 40.21,46.53 F5.1 40.41,46.74 v41.43,46.74 | v52.86,45.92 52.25,45.31 52.25,37.15 52.86,36.53 53.27,36.53 54.29,37.55 54.29,38.78 7.1 54.29,38.98 v53.47,39.8 | v51.64,46.74 51.64,50.82 51.23,51.23 U$1.P$14 | v72.66,38.98 71.64,38.98 0.3 | v90.42,54.29 91.03,54.29
  Bottom 0.203: v39.8,37.35 v31.43,28.98 | v52.86,45.92 52.45,45.92 v51.64,46.74 | v72.66,38.98 70.62,38.98 67.56,42.05 65.11,42.05 | 65.11,42.05 58.17,42.05 55.92,39.8 v53.47,39.8 | v41.43,46.74 44.7,46.74 46.13,48.17 46.74,48.17 46.94,47.96 58.98,47.96 61.03,45.92 62.66,45.92 | 62.66,45.92 63.27,45.92 65.11,44.09 65.11,42.05 | v90.42,54.29 79.8,54.29 79.39,53.88 77.56,53.88 71.23,47.55 63.27,47.55 62.66,46.94 62.66,45.92
15  (via drill 0.3)
  Top 0.203: BR-LEFT.1 82.46,31.23 82.46,31.64 84.91,34.09 84.91,34.29 85.31,34.7 85.72,34.7 89.4,38.37 89.4,38.78 PLUS.1 89.4,38.98 v88.38,38.98 | v82.25,45.11 82.25,46.53 F11.1 | v90.42,58.17 90.42,72.66 89.6,73.48 89.6,77.35 UP.1 | v6.12,26.74 6.12,24.49 5.51,23.88 5.51,23.47 CAPS.1 | v20.41,30.41 19.59,31.23 W.1 | U$1.P$15 52.45,51.23 52.45,46.53 51.84,45.92 51.84,36.94 52.66,36.13 52.66,25.51 54.29,23.88 54.29,23.47 J.1 54.29,23.27 53.88,22.86 v53.88,20.82 | v85.31,11.43 84.09,10.21 84.09,6.53 81.23,3.67 v48.98,3.67
  Bottom 0.203: v88.38,38.98 83.27,44.09 | 83.27,44.09 v82.25,45.11 | v90.42,58.17 90.42,55.52 92.66,53.27 92.66,52.86 92.05,52.25 | 92.05,52.25 90.42,52.25 89.8,52.86 86.54,52.86 84.09,50.41 84.09,44.9 83.27,44.09 | v6.12,26.74 9.8,30.41 v20.41,30.41 21.84,30.41 26.33,25.92 26.33,13.88 29.59,10.61 43.06,10.61 | 43.06,10.61 53.27,20.82 v53.88,20.82 | 92.05,52.25 92.05,50.62 96.33,46.33 96.33,22.45 v85.31,11.43 | v48.98,3.67 48.98,4.69 43.06,10.61
16  (via drill 0.3)
  Top 0.203: v83.27,45.31 83.27,40.21 82.46,39.39 82.46,38.98 MINUS.1 | v83.27,56.74 v83.27,52.66 | v95.31,68.58 96.33,69.6 RIGHT.1 | 2.3 15.51,38.78 15.51,35.31 14.9,34.7 14.9,31.84 12.86,29.8 11.23,29.8 7.76,26.33 7.76,22.45 8.16,22.04 8.98,22.04 10.21,23.27 12.25,23.27 A.1 12.45,23.27 v14.08,23.27 | 56.54,28.37 55.92,28.98 55.92,46.74 54.09,48.58 54.09,51.23 U$1.P$16 | 56.54,28.37 57.35,27.55 57.76,27.55 61.23,31.02 I.1 | v23.88,22.66 25.31,22.66 25.92,22.04 v32.66,22.04 | 56.54,28.37 v56.13,27.96 | v27.55,46.53 27.55,45.92 23.68,42.05 22.04,42.05 20.21,40.21 20.21,35.72 18.37,33.88 v18.37,24.49
  Bottom 0.203: v83.27,52.66 v83.27,45.31 | v95.31,68.58 91.44,68.58 83.27,60.41 v83.27,56.74 81.64,56.74 79.19,54.29 77.35,54.29 72.25,49.19 66.74,49.19 66.33,49.6 29.39,49.6 28.17,48.37 27.14,48.37 26.53,47.76 26.53,47.35 27.35,46.53 v27.55,46.53 | 17.14,23.27 17.55,23.27 18.16,22.66 v23.88,22.66 | 17.14,23.27 v14.08,23.27 | v32.66,22.04 37.15,26.53 54.7,26.53 v56.13,27.96 | 17.14,23.27 v18.37,24.49
17  (via drill 0.3)
  Top 0.203: VOL-UP.3 8.78,77.56 10,78.78 12.86,78.78 13.27,78.37 13.27,76.95 15.51,74.7 15.51,69.8 S-HOME.3 15.51,69.6 15.51,65.72 v13.68,63.88 | R-SH.1 89.6,15.72 89.6,16.12 91.84,18.37 91.84,18.78 96.33,23.27 HOME.1 96.33,23.47 96.33,23.88 93.89,26.33 93.89,33.68 92.25,35.31 89.8,35.31 86.74,32.25 86.74,28.98 83.27,25.51 83.27,22.45 82.46,21.64 81.23,21.64 80.42,22.45 v80.42,22.66 | 34.29,16.94 35.72,18.37 35.72,28.57 37.35,30.21 37.35,34.09 37.15,34.29 36.13,34.29 | 34.29,16.94 33.47,16.12 33.47,15.72 C.1 | 36.13,34.29 35.92,34.29 34.29,32.66 34.29,32.04 33.47,31.23 R.1 | v39.39,15.72 40.21,15.72 V.1 | 34.29,16.94 v35.51,15.72 | N.1 54.29,15.72 54.29,16.12 52.25,18.16 v52.25,21.02 51.43,21.84 51.43,26.33 48.98,28.78 v48.98,30 | v65.11,20 68.37,23.27 L.1 68.58,23.27 69.39,22.45 v70.62,22.45 | v56.74,37.55 56.74,46.53 55.31,47.96 55.31,51.23 U$1.P$17 | v16.74,47.96 16.74,46.13 17.14,45.72 17.14,40.21 v18.37,38.98 | 36.13,34.29 v32.25,38.17
  Bottom 0.203: v35.51,15.72 v39.39,15.72 44.7,21.02 v52.25,21.02 52.86,21.64 54.09,21.64 56.74,18.98 58.37,18.98 59.39,20 v65.11,20 | v56.74,37.55 55.92,37.55 48.98,30.61 v48.98,30 | v80.42,22.66 70.82,22.66 v70.62,22.45 | v13.68,63.88 13.68,51.02 v16.74,47.96 | v18.37,38.98 31.43,38.98 v32.25,38.17
18  (via drill 0.3)
  Top 0.203: v56.33,20.41 56.54,20.41 61.23,15.72 M.1 61.43,15.72 62.05,16.33 v62.45,16.33 | v48.37,22.45 47.55,23.27 H.1 | v63.48,22.45 63.07,22.04 61.03,22.04 60.62,22.45 60.62,26.33 62.25,27.96 62.25,33.27 65.31,36.33 65.31,41.84 65.11,42.05 60.01,42.05 57.96,44.09 57.96,44.49 58.37,44.9 58.37,47.35 57.96,47.76 57.76,47.76 56.74,48.78 56.74,51.23 U$1.P$18 | v91.03,32.66 89.6,31.23 BR-RIGHT.1 89.4,31.02 83.68,25.31 83.68,6.74 81.03,4.08 50.41,4.08 | 95.52,45.11 95.52,45.72 96.33,46.53 PGDOWN.1 | 95.52,45.11 v95.52,37.15 | v87.97,50.21 84.7,50.21 82.46,52.45 82.46,54.29 INS.1 | 95.52,45.11 v93.07,45.11 | v11.23,15.72 12.25,15.72 L-SH.1 12.45,15.51 13.27,14.7 13.27,7.14 15.51,4.9 48.78,4.9 49.6,4.08 50.41,4.08 | v3.06,36.53 5.31,38.78 B-QUOTE.1 | v31.43,36.53 31.43,38.37 32.04,38.98 33.27,38.98 4.1 | v8.57,58.37 8.57,61.84 VOL-DOWN.3 | 50.41,4.08 v50.41,4.49
  Bottom 0.203: v56.33,20.41 55.92,20.41 53.88,22.45 v48.37,22.45 | v63.48,22.45 65.11,20.82 65.31,20.82 65.92,20.21 65.92,19.8 v62.45,16.33 56.74,16.33 53.27,19.8 52.86,19.8 50.01,16.94 50.01,14.7 49.6,14.29 49.6,11.43 50.41,10.61 v50.41,4.49 | v95.52,37.15 v91.03,32.66 | v93.07,45.11 v87.97,50.21 | v11.23,15.72 11.23,16.12 3.06,24.29 v3.06,36.53 4.9,38.37 | v31.43,36.53 17.14,36.53 15.31,38.37 4.9,38.37 | v8.57,58.37 8.57,57.15 3.06,51.64 3.06,40.21 4.9,38.37
19  (via drill 0.3)
  Top 0.203: v91.84,34.49 91.84,26.12 89.6,23.88 89.6,23.47 ENTER_1.1 | v94.29,47.35 94.29,52.25 95.52,53.47 | 95.52,53.47 96.33,54.29 PGUP.1 | v89.6,65.72 89.6,69.6 ENTER_2.1 | 95.52,53.47 v95.31,53.68 | v29.8,11.43 33.27,7.96 L-ALT.1 33.47,7.96 36.33,7.96 39.59,11.23 40.82,11.23 41.23,10.82 41.23,8.98 43.68,6.53 48.78,6.53 53.47,11.23 54.9,11.23 55.11,11.02 55.11,8.57 58.78,4.9 71.64,4.9 74.09,7.35 74.09,10.41 77.56,13.88 v82.25,13.88 | v27.14,14.08 27.14,14.9 26.53,15.51 X.1 | v40.21,21.84 40.21,23.27 G.1 | v14.7,35.51 12.45,37.76 12.45,38.78 1.1 12.45,38.98 13.27,39.8 13.27,49.6 v12.65,50.21 | v26.33,34.7 26.33,38.78 3.1 | v8.78,66.94 8.78,69.6 MUTE.3 | v58.78,44.29 58.78,47.55 58.17,48.17 58.17,51.23 U$1.P$19 | v54.29,42.45 52.66,40.82 52.66,37.76 v53.07,37.35
  Bottom 0.203: v94.29,47.35 94.29,37.35 91.84,34.9 v91.84,34.49 86.74,29.39 86.74,18.37 v82.25,13.88 | v89.6,65.72 89.6,60.01 91.23,58.37 91.23,57.76 v95.31,53.68 | v40.21,21.84 v29.8,11.43 v27.14,14.08 27.14,23.47 | v14.7,35.51 16.94,35.51 21.64,30.82 22.04,30.82 22.25,30.61 | 22.25,30.61 27.14,25.72 27.14,23.47 | 22.25,30.61 v26.33,34.7 | v8.78,66.94 8.78,65.11 12.65,61.23 v12.65,50.21 | v58.78,44.29 56.13,44.29 v54.29,42.45 | v53.07,37.35 43.88,37.35 31.43,24.9 31.43,24.08 30.82,23.47 27.14,23.47
20  (via drill 0.3)
  Top 0.203: R-ALT.3 64.7,7.76 66.74,5.71 71.23,5.71 73.27,7.76 73.27,13.47 75.31,15.51 DOT.1 75.52,15.72 v76.54,16.74 | v81.44,22.45 82.25,23.27 QUOTE.1 82.25,23.47 82.25,23.88 80.21,25.92 80.21,32.86 84.91,37.55 84.91,42.05 F12.1 89.4,46.74 86.33,49.8 77.97,49.8 75.52,47.35 75.52,46.74 F10.1 75.31,46.74 v72.66,46.74 | v55.11,44.7 55.52,44.29 55.52,32.66 54.49,31.64 54.49,31.23 U.1 | v59.6,45.72 59.6,51.23 U$1.P$20 | v4.29,69.6 1.63,69.6 PLAY.3 | 67.35,46.53 68.37,46.53 F9.1 | 67.35,46.53 65.52,44.7 v62.45,44.7 | 67.35,46.53 v67.35,46.74
  Bottom 0.203: v76.54,16.74 76.54,17.55 v81.44,22.45 | v4.29,69.6 8.98,69.6 15.1,63.48 15.1,57.96 17.96,55.11 18.57,55.11 22.04,51.64 22.04,51.02 27.96,45.11 54.7,45.11 v55.11,44.7 58.17,44.7 59.19,45.72 v59.6,45.72 60.62,44.7 v62.45,44.7 | v67.35,46.74 v72.66,46.74
21  (via drill 0.3)
  Top 0.203: 19.39,12.25 19.39,15.51 Z.1 | 19.39,12.25 19.39,12.04 15.72,8.37 15.72,7.96 L-CTRL.3 | SPACE_1.1 57.56,7.96 56.74,8.78 56.74,10 55.11,11.63 v52.86,11.63 50.62,11.63 49.8,10.82 49.8,10.61 47.15,7.96 44.29,7.96 SPACE_2.1 44.09,7.76 42.86,8.98 42.86,9.8 40.41,12.25 19.39,12.25 | ESC.1 5.51,46.74 5.51,47.15 6.12,47.76 6.12,53.68 5.51,54.29 MAIL.1 5.51,54.49 5.51,55.11 7.96,57.56 13.06,57.56 15.51,55.11 15.51,54.49 POWER.3 15.72,54.29 16.12,53.88 v16.12,52.86 | v18.57,50.41 18.57,47.55 19.39,46.74 F2.1 19.59,46.53 20.41,46.53 22.04,44.9 24.7,44.9 26.33,46.53 F3.1 26.53,46.74 v27.35,47.55 | v49.6,41.43 47.55,39.39 47.55,38.98 6.1 47.55,38.78 48.17,38.17 48.17,31.84 51.84,28.17 51.84,25.72 53.07,24.49 v53.07,18.98 | v60.41,38.58 61.03,38.58 61.23,38.78 8.1 | 60.62,47.35 60.41,47.15 60.41,44.9 v59.8,44.29 | 60.62,47.35 60.82,47.55 60.82,51.23 U$1.P$21 | 60.62,47.35 v60.41,47.55
  Bottom 0.203: v16.12,52.86 v18.57,50.41 | v60.41,38.58 52.86,38.58 50.01,41.43 v49.6,41.43 48.17,42.86 48.17,43.27 48.78,43.88 49.19,43.88 51.43,41.64 57.15,41.64 v59.8,44.29 | v27.35,47.55 37.15,47.55 38.17,48.58 46.94,48.58 47.15,48.37 59.6,48.37 v60.41,47.55 | v52.86,11.63 52.86,18.78 v53.07,18.98
22  (via drill 0.3)
  Top 0.203: v18.37,54.29 19.39,54.29 POWER.1 19.59,54.49 20.82,55.72 20.82,64.5 19.59,65.72 19.59,69.6 S-HOME.1 | CALC.1 12.45,54.29 v14.49,54.29 v14.49,36.74 | 88.99,14.29 93.07,14.29 94.29,15.51 96.33,15.51 END.1 | 88.99,14.29 88.58,14.7 88.58,18.57 92.05,22.04 93.07,22.04 93.48,22.45 93.48,30.21 92.66,31.02 PIPE.3 | v2.65,23.27 1.63,23.27 CAPS.3 | v20.61,11.23 26.74,11.23 29.59,8.37 29.59,7.96 L-ALT.3 | v67.15,6.53 68.37,7.76 R-ALT.1 | v63.48,46.74 62.45,47.76 62.45,51.23 U$1.P$22 | 88.99,14.29 88.99,11.23 86.74,8.98 v86.74,7.76
  Bottom 0.203: v18.37,54.29 v14.49,54.29 | 11.23,14.7 14.7,11.23 v20.61,11.23 23.06,8.78 30.61,8.78 36.74,2.65 49.6,2.65 53.47,6.53 v67.15,6.53 67.56,6.12 85.11,6.12 85.72,6.74 85.72,7.14 | 11.23,14.7 v2.65,23.27 | v63.48,46.74 65.11,46.74 72.05,39.8 72.86,39.8 74.7,37.96 74.7,34.49 82.66,26.53 82.66,16.53 80.21,14.08 80.21,11.23 83.68,7.76 85.11,7.76 85.72,7.14 | v86.74,7.76 86.33,7.76 85.72,7.14 | v14.49,36.74 3.47,25.72 3.47,24.49 12.04,15.92 12.04,15.51 11.23,14.7
23  (via drill 0.3)
  Top 0.203: U$1.P$23 63.88,51.23 63.88,48.58 64.5,47.96 68.58,47.96 69.6,46.94 69.6,36.94 70.62,35.92 71.03,35.92 73.88,38.78 75.31,38.78 0.1 75.52,38.78 v75.52,36.33 | VOL-UP.1 12.25,77.35 12.25,73.48 11.63,72.86 11.63,70.42 12.25,69.8 MUTE.1 12.25,69.6 11.63,68.99 11.63,63.27 12.25,62.66 12.25,62.05 VOL-DOWN.1 12.25,61.84 v11.02,61.84 | v21.64,7.76 19.59,7.76 L-CTRL.1 | v79.8,5.31 82.25,7.76 R-CTRL.1
  Bottom 0.203: v11.02,61.84 2.86,61.84 1.23,60.21 1.23,22.04 15.51,7.76 v21.64,7.76 31.02,7.76 36.53,2.25 76.74,2.25 v79.8,5.31 85.72,5.31 87.97,7.55 87.97,7.96 87.36,8.57 83.48,8.57 80.62,11.43 80.62,13.88 83.07,16.33 83.07,26.74 75.52,34.29 v75.52,36.33
24  (via drill 0.3)
  Top 0.203: 17.55,51.23 17.55,54.29 9.39,62.45 9.39,65.31 5.51,69.19 5.51,69.6 PLAY.1 | 17.55,51.23 17.55,41.23 19.39,39.39 19.39,38.98 2.1 19.39,38.78 17.96,37.35 17.96,30.21 14.9,27.14 14.9,6.74 15.1,6.53 23.06,6.53 24.29,7.76 26.33,7.76 WIN.1 | v66.13,51.23 65.11,51.23 U$1.P$24 | 17.55,51.23 v22.86,51.23
  Bottom 0.203: v66.13,51.23 29.8,51.23 27.76,49.19 25.72,49.19 24.49,50.41 24.49,50.62 23.88,51.23 v22.86,51.23

### Text on the board
bNames: Logitech K270 controller / Andrew Sozonnyk, 2019
tDocu: K270